# Altium schematic sheet Test_Ckt.SchDoc: LM-008 Test Ckt
size OrCAD A; Revision: A; SheetNumber: 1; SheetTotal: 1
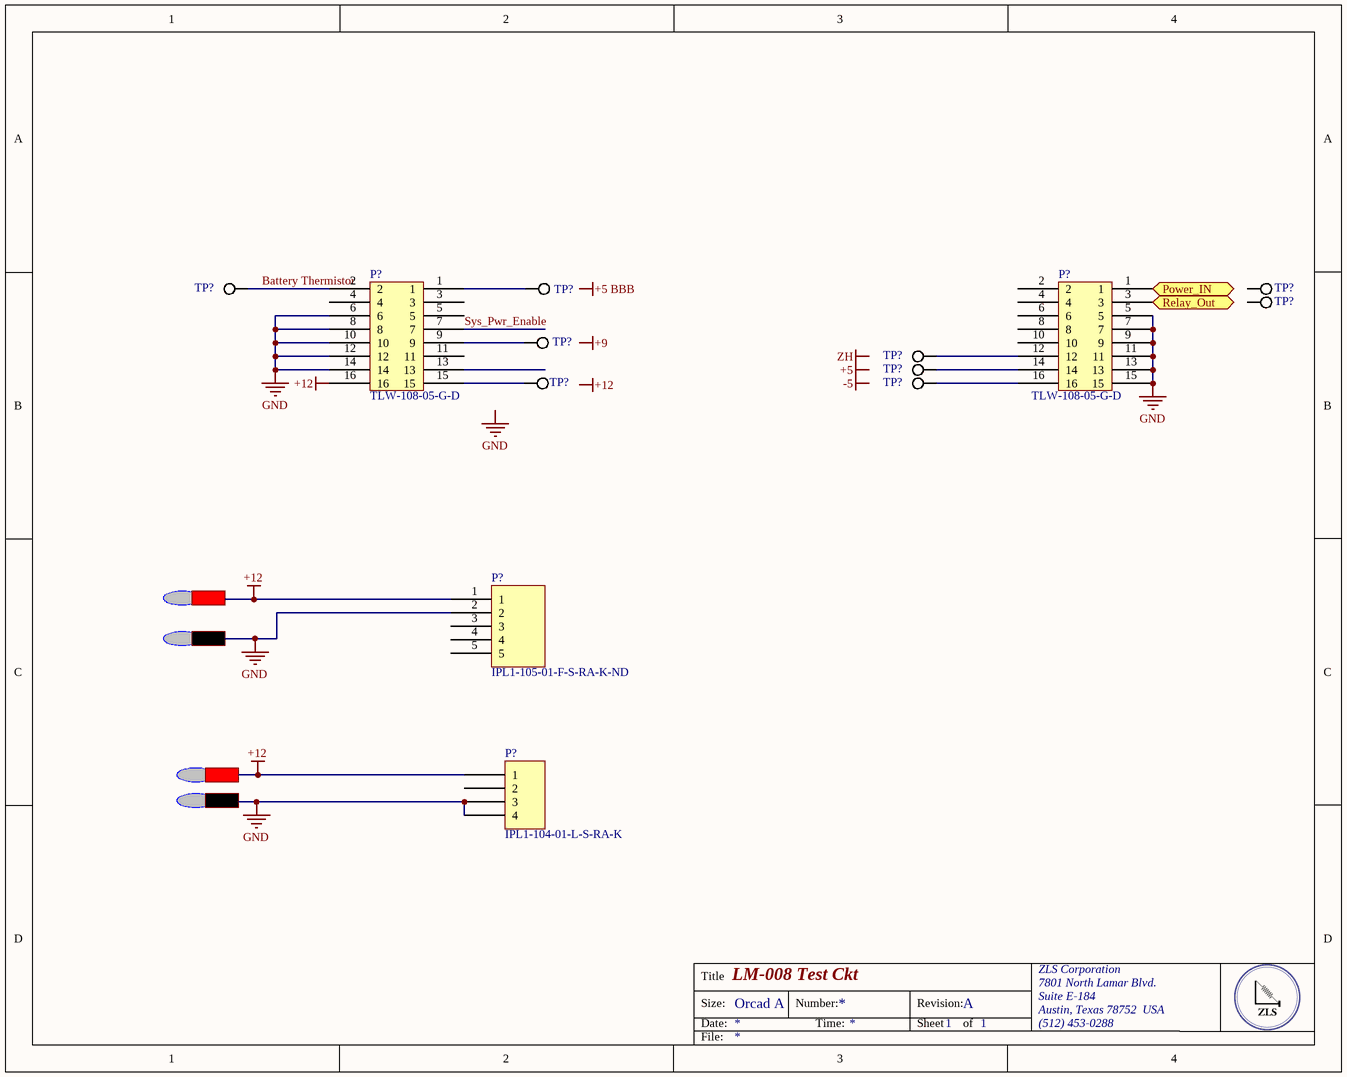
[diagram p0: Test_Ckt.SchDoc]

## Parts
(Parts that share a designator on the sheet are numbered #1, #2 ... from top to bottom, then left to right.)
P?#1  TLW-108-05-G-D  [TLW-108-05-G-D]
P?#2  TLW-108-05-G-D  [TLW-108-05-G-D]
P?#3  Supplier Part Number 1: IPL1-105-01-F-S-RA-K-ND  [IPL1-105-01-F-S-RA]  (hidden comment: IPL1-105-01-F-S-RA)
P?#4  IPL1-104-01-L-S-RA-K  [IPL1-104-01-L-S-RA-K]
TP?#1  5019  [KSTN-5019_V]  (value not drawn)
TP?#2  5019  [KSTN-5019_V]  (value not drawn)
TP?#3  5019  [KSTN-5019_V]  (value not drawn)
TP?#4  5019  [KSTN-5019_V]  (value not drawn)
TP?#5  5019  [KSTN-5019_V]  (value not drawn)
TP?#6  5019  [KSTN-5019_V]  (value not drawn)
TP?#7  5019  [KSTN-5019_V]  (value not drawn)
TP?#8  5019  [KSTN-5019_V]  (value not drawn)
TP?#9  5019  [KSTN-5019_V]  (value not drawn)

## Ports
Power_IN, Relay_Out

## Nets
+12: P?#1.16 P?#3.1 P?#4.1
GND: P?#1.6 P?#1.8 P?#1.10 P?#1.12 P?#1.14 P?#2.5 P?#2.7 P?#2.9 P?#2.11 P?#2.13 P?#2.15 P?#3.2 P?#4.3 P?#4.4
Battery Thermistor: P?#1.2 TP?#1.1
Power_IN: P?#2.1 ; port Power_IN
Relay_Out: P?#2.3 ; port Relay_Out
Sys_Pwr_Enable: P?#1.7
NetP?#1_1: P?#1.1 TP?#2.1
NetP?#1_9: P?#1.9 TP?#5.1
NetP?#1_15: P?#1.15 TP?#8.1
NetP?#2_12: P?#2.12 TP?#6.1
NetP?#2_14: P?#2.14 TP?#7.1
NetP?#2_16: P?#2.16 TP?#9.1

Not connected (* = marked no-connect by the designer): P?#1 3 4 5 11 13; P?#2 2 4 6 8 10; P?#3 3 4 5; P?#4 2; TP?#3 1; TP?#4 1

## Notes on the sheet
- Labels drawn without touching a wire or pin: +5, +5 BBB, +9, +12, -5, GND, ZH
- Title
- Size:
- Date:
- Orcad A
- Number:
- Time:
- Revision:
- Sheet
- of
- ZLS Corporation
- 7801 North Lamar Blvd.
- Suite E-184
- Austin, Texas 78752  USA
- (512) 453-0288
- File:

## Library data of the parts
P?#1 P?#2 = TLW-108-05-G-D: CONN HEADER .100" 16POS DL GOLD; Manufacturer: Samtec Inc.; Pitch - Mating: 0.100" (2.54mm); Number of Positions: 16; Number of Positions Loaded: All; Style: Board to Board or Cable; Shrouding: Unshrouded; Contact Length - Mating: 0.105" (2.67mm); Contact Length - Post: 0.170" (4.32mm); Overall Contact Length: 0.335" (8.51mm); Current Rating: 5.2A per Contact; Supplier 1: Digi-Key; Supplier Part Number 1: SAM1094-08-ND; Manufacturer Part Number: TLW-108-05-G-D; RoHS: RoHS Compliant; Category: Connectors, Interconnects; Stock 1: 0; Pricing 1: 1=4.48, 10=4.006, 100=3.2987, 500=2.60756, 1000=2.23842, 5000=2.04207, 10000=1.96353 (USD); Packaging: Bulk; Part Status: Active; Connector Type: Header; Contact Type: Male Pin; Number of Rows: 2; Row Spacing - Mating: 0.100" (2.54mm); Mounting Type: Through Hole; Termination: Solder; Fastening Type: Push-Pull; Insulation Height: 0.060" (1.52mm); Contact Shape: Square; Contact Finish - Mating: Gold; Contact Finish Thickness - Mating: 10µin (0.25µm); Contact Finish - Post: Gold; Contact Material: Phosphor Bronze; Insulation Material: Liquid Crystal Polymer (LCP); Features: -; Operating Temperature: -55°C ~ 125°C; Ingress Protection: -; Material Flammability Rating: -; Insulation Color: Black; Voltage Rating: -; Mated Stacking Heights: -; Contact Finish Thickness - Post: Flash; Applications: -; ComponentLink1URL: http://suddendocs.samtec.com/prints/tlw-mkt.pdf; ComponentLink1Description: http://suddendocs.samtec.com/prints/tlw-mkt.pdf
P?#4 = IPL1-104-01-L-S-RA-K: Manufacturer: Samtec Inc.; Connector Type: Header; Pitch - Mating: 0.100" (2.54mm); Number of Positions: 4; Number of Positions Loaded: All; Style: Board to Cable/Wire; Shrouding: Shrouded - 4 Wall; Contact Length - Mating: 0.215" (5.46mm); Contact Length - Post: 0.085" (2.16mm); Material Flammability Rating: UL94 V-0; Voltage Rating: 675VAC, 954VDC; Supplier 1: Digi-Key; Supplier Part Number 1: SAM9597-ND; Manufacturer Part Number: IPL1-104-01-L-S-RA-K; RoHS: RoHS Compliant; Category: Connectors, Interconnects; Stock 1: 265; Pricing 1: 1=2.53, 10=2.424, 100=2.02, 500=1.717, 1000=1.4645, 5000=1.313 (USD); Packaging: Tube; Part Status: Active; Contact Type: Male Pin; Number of Rows: 1; Row Spacing - Mating: -; Mounting Type: Through Hole, Right Angle; Termination: Solder; Fastening Type: Locking Ramp; Overall Contact Length: -; Insulation Height: 0.240" (6.10mm); Contact Shape: Square; Contact Finish - Mating: Gold; Contact Finish Thickness - Mating: 10µin (0.25µm); Contact Finish - Post: Tin; Contact Material: Phosphor Bronze; Insulation Material: Liquid Crystal Polymer (LCP); Features: -; Operating Temperature: -55°C ~ 125°C; Ingress Protection: -; Insulation Color: Natural; Current Rating: -; Mated Stacking Heights: -; Contact Finish Thickness - Post: -; Applications: -; ComponentLink1URL: http://suddendocs.samtec.com/prints/ipl1-1xx-xx-xxx-s-xx-x-xx-mkt.pdf; ComponentLink1Description: http://suddendocs.samtec.com/prints/ipl1-1xx-xx-xxx-s-xx-x-xx-mkt.pdf
TP?#1-TP?#9 = CMP-1672-00008-1: Test Point, 1 Position SMD, RoHS, Tape and Reel; ComponentLink1Description: Manufacturer URL; Package Quantity: 1000; DatasheetVersion: 03/2014; Packaging: Tape and Reel; ComponentLink2URL: http://www.keyelco.com/product-pdf.cfm?p=1357; ComponentLink1URL: http://www.keyelco.com/; Mount: Surface Mount; Contact Plating: Silver; PackageDescription: 1-Pin Surface Mount Device, Body 3.81 x 2.03 mm; Pins: 1; RoHSCompliant: True; Mounting Technology: Surface Mount; ComponentLink2Description: Datasheet; PackageReference: 5019
P?#3 = IPL1-105-01-F-S-RA: Supplier 1: Digi-Key